# Altium schematic sheet pca10156_sheet3_debugger.SchDoc: =BoardTitle+' - IMCU'
size A3; Organization: Nordic Semiconductor; DocumentNumber: 3; SheetNumber: 3; SheetTotal: 7; CompanyName: Nordic Semiconductor; DocumentSize: A4
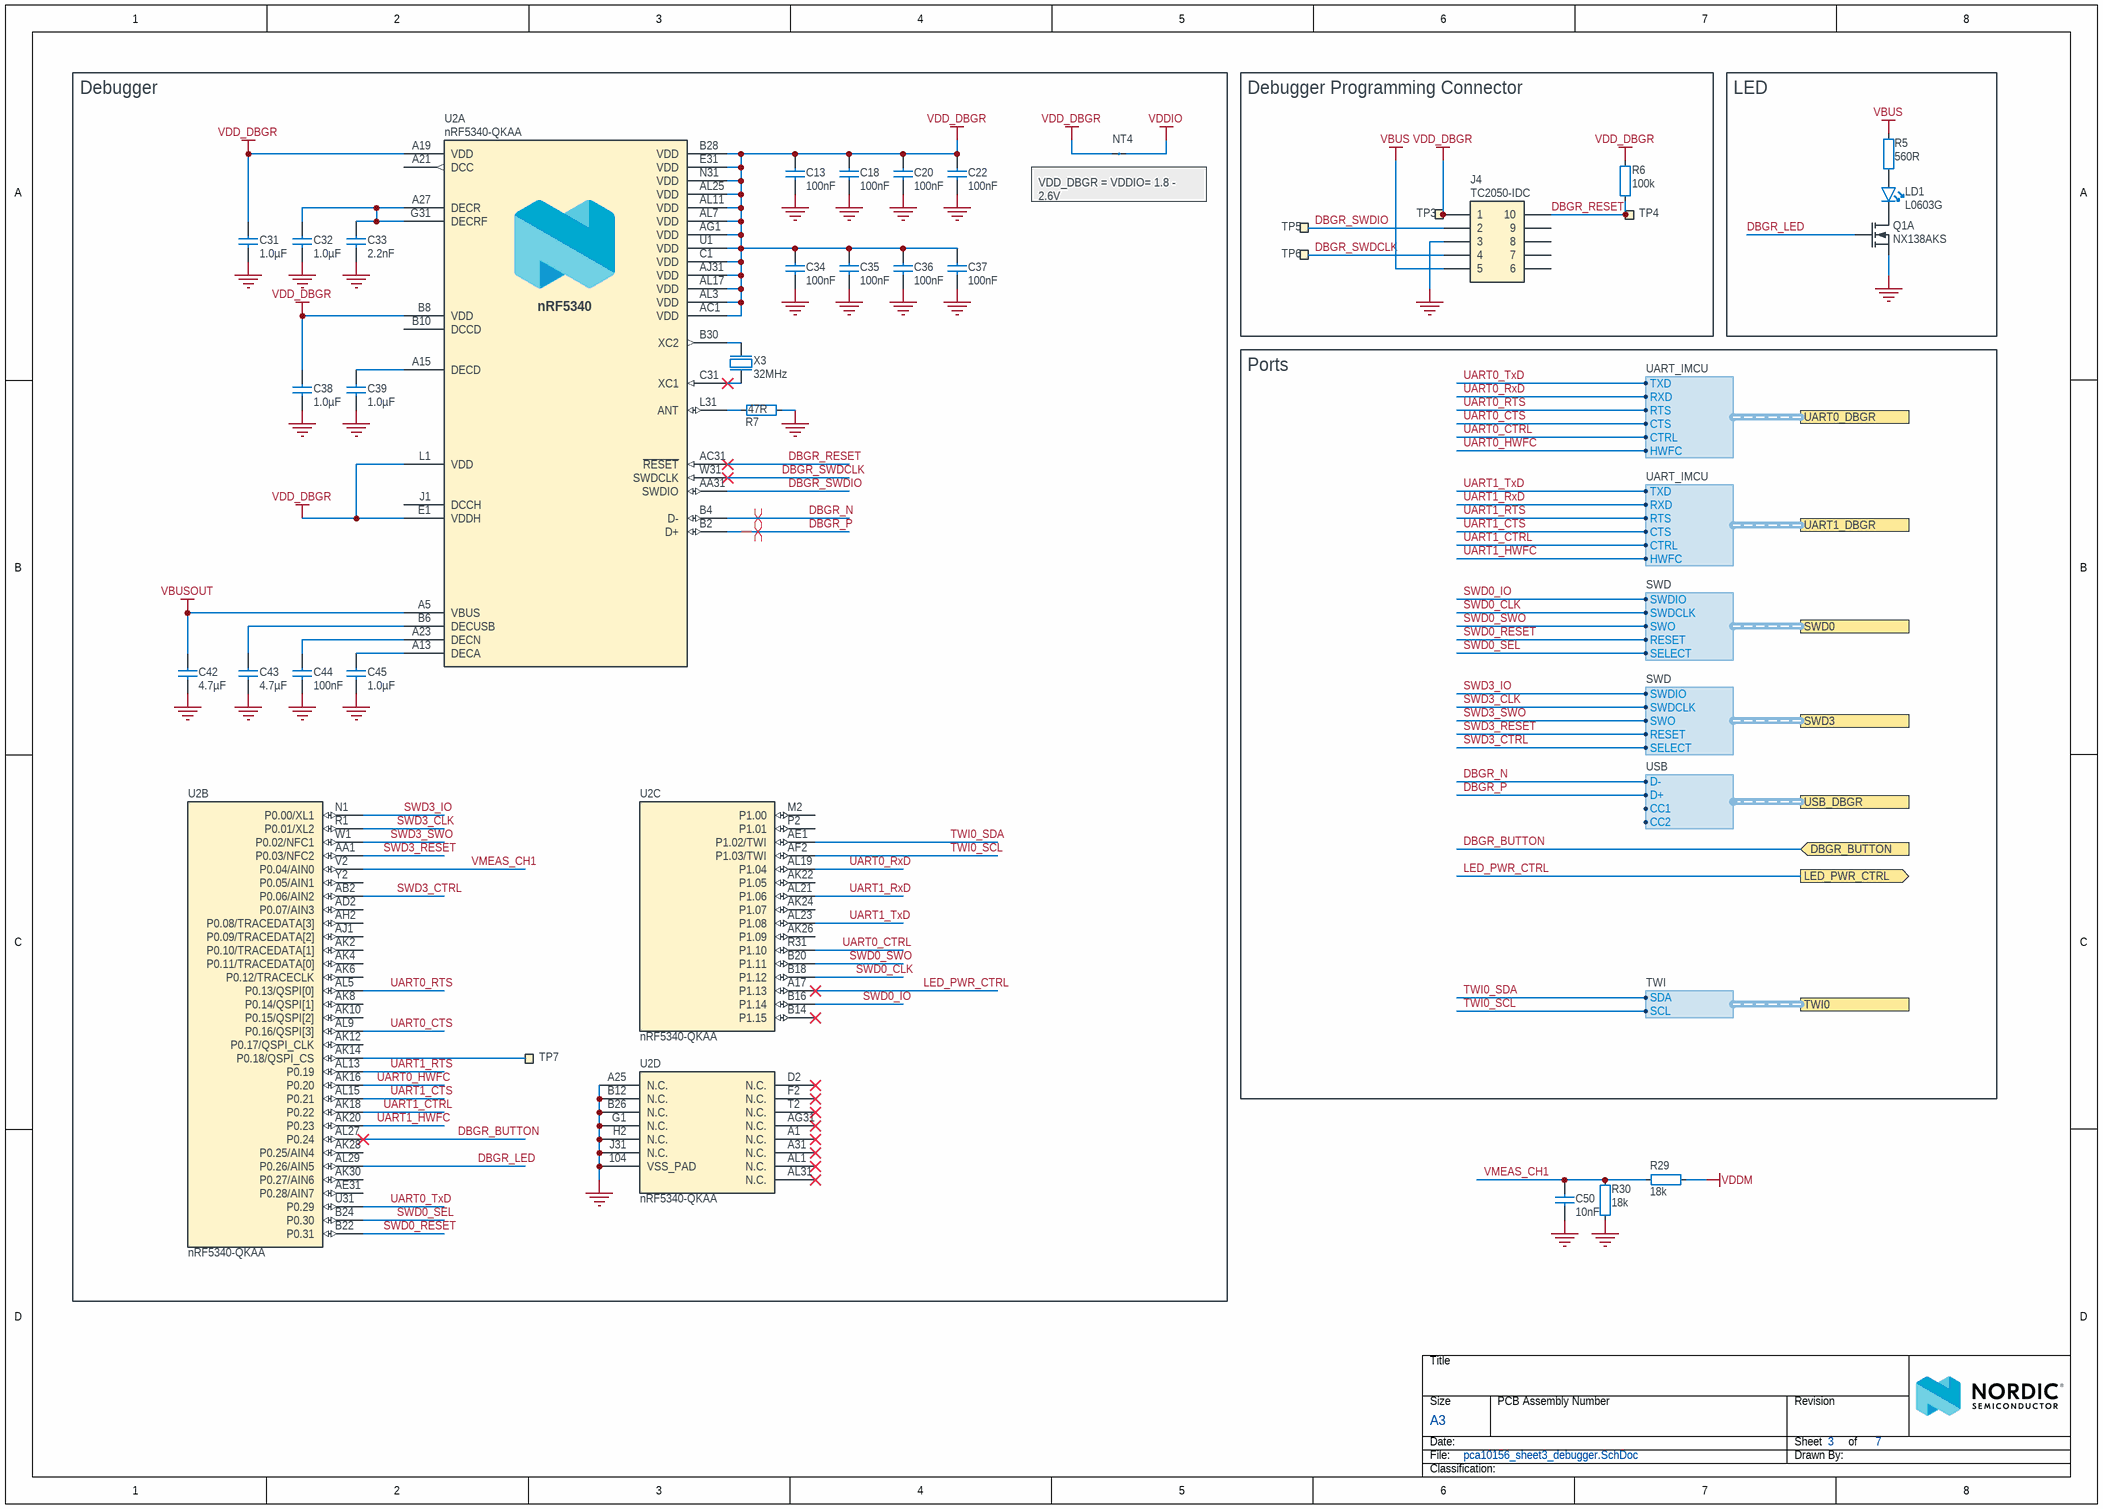
[diagram p0: pca10156_sheet3_debugger.SchDoc]

## Parts
C13  100nF  [CAPC0603X03L_C]
C18  100nF  [CAPC0603X03L_C]
C20  100nF  [CAPC0603X03L_C]
C22  100nF  [CAPC0603X03L_C]
C31  1.0µF  [CAPC1005X04L]
C32  1.0µF  [CAPC1005X04L]
C33  2.2nF  [CAPC0603X03L_C]
C34  100nF  [CAPC0603X03L_C]
C35  100nF  [CAPC0603X03L_C]
C36  100nF  [CAPC0603X03L_C]
C37  100nF  [CAPC0603X03L_C]
C38  1.0µF  [CAPC1005X04L]
C39  1.0µF  [CAPC1005X04L]
C42  4.7µF  [CAPC1608X06L]
C43  4.7µF  [CAPC1608X06L]
C44  100nF  [CAPC0603X03L_C]
C45  1.0µF  [CAPC1005X04L]
C50  10nF  [CAPC0603X03L_C]
J4  TC2050-IDC  [TC2050-IDC-NLFP]  (no BOM)
LD1  L0603G  [LED_0603_G]
NT4  N.A.  [2 pin starpoint 20mil]  (value not drawn)  (net tie, no BOM)
Q1  NX138AKS  [TSSOP6]  (part A of 2)
R5  560R  [RESC0603X03L_C]
R6  100k  [RESC0603X03L_C]
R7  47R  [RESC0603X03L_C]
R29  18k  [RESC0603X03L_C]
R30  18k  [RESC0603X03L_C]
TP3  Ø1.5mm,SMD  [TP_SMD_D1.5mm]  (value not drawn)  (no BOM)
TP4  Ø1.5mm,SMD  [TP_SMD_D1.5mm]  (value not drawn)  (no BOM)
TP5  Ø1.5mm,SMD  [TP_SMD_D1.5mm]  (value not drawn)  (no BOM)
TP6  Ø1.5mm,SMD  [TP_SMD_D1.5mm]  (value not drawn)  (no BOM)
TP7  Ø1.5mm,SMD  [TP_SMD_D1.5mm]  (value not drawn)  (no BOM)
U2  nRF5340-QKAA  [AQFN40P700X700X85_HS-99N]  (parts A,B,C,D of 4)
X3  32MHz  [BT-XTAL_2016]

## Blocks framed on the sheet
Debugger: C13 C18 C20 C22 C31-C39 C42-C45 NT4 R7 TP7 U2 X3
Debugger Programming Connector: J4 R6 TP3-TP6
LED: LD1 Q1 R5

## Ports
DBGR_BUTTON (in), LED_PWR_CTRL (out), SWD0 (harness SWD), SWD3 (harness SWD), TWI0 (harness TWI), UART0_DBGR (harness UART_IMCU), UART1_DBGR (harness UART_IMCU), USB_DBGR (harness USB)

## Harnesses
SWD: SWDIO, SWDCLK, SWO, RESET, SELECT
UART_IMCU: RTS, CTS, RXD, TXD, HWFC, CTRL
TWI: SCL, SDA
USB: D+, D-, CC1, CC2

## Nets
GND: C13.2 C18.2 C20.2 C22.2 C31.2 C32.1 C33.2 C34.2 C35.2 C36.2 C37.2 C38.1 C39.1 C42.2 C43.2 C44.2 C45.1 C50.2 J4.3 Q1.1(S1) R7.2 R30.1 U2.104(VSS_PAD) U2.A25(N.C.) U2.B12(N.C.) U2.B26(N.C.) U2.G1(N.C.) U2.H2(N.C.) U2.J31(N.C.) X3.2(GND) X3.4(GND)
VBUS: J4.5 R5.2
VBUSOUT: C42.1 U2.A5(VBUS)
VDD_DBGR: C13.1 C18.1 C20.1 C22.1 C31.1 C34.1 C35.1 C36.1 C37.1 C38.2 J4.1 NT4.1 R6.2 TP3.1 U2.A19(VDD) U2.AC1(VDD) U2.AG1(VDD) U2.AJ31(VDD) U2.AL3(VDD) U2.AL7(VDD) U2.AL11(VDD) U2.AL17(VDD) U2.AL25(VDD) U2.B8(VDD) U2.B28(VDD) U2.C1(VDD) U2.E1(VDDH) U2.E31(VDD) U2.L1(VDD) U2.N31(VDD) U2.U1(VDD)
VDDIO: NT4.2
VDDM: R29.2
DBGR_BUTTON: U2.AL27(P0.24) ; port DBGR_BUTTON
DBGR_LED: Q1.2(G1) U2.AL29(P0.26/AIN5)
DBGR_N: U2.B4(D-) ; port USB_DBGR.D-
DBGR_P: U2.B2(D+) ; port USB_DBGR.D+
DBGR_RESET: J4.10 R6.1 TP4.1 U2.AC31(~{RESET})
DBGR_SWDCLK: J4.4 TP6.1 U2.W31(SWDCLK)
DBGR_SWDIO: J4.2 TP5.1 U2.AA31(SWDIO)
LED_PWR_CTRL: U2.A17(P1.13) ; port LED_PWR_CTRL
SWD0_CLK: U2.B18(P1.12) ; port SWD0.SWDCLK
SWD0_IO: U2.B16(P1.14) ; port SWD0.SWDIO
SWD0_RESET: U2.B22(P0.31) ; port SWD0.RESET
SWD0_SEL: U2.B24(P0.30) ; port SWD0.SELECT
SWD0_SWO: U2.B20(P1.11) ; port SWD0.SWO
SWD3_CLK: U2.R1(P0.01/XL2) ; port SWD3.SWDCLK
SWD3_CTRL: U2.AB2(P0.06/AIN2) ; port SWD3.SELECT
SWD3_IO: U2.N1(P0.00/XL1) ; port SWD3.SWDIO
SWD3_RESET: U2.AA1(P0.03/NFC2) ; port SWD3.RESET
SWD3_SWO: U2.W1(P0.02/NFC1) ; port SWD3.SWO
TWI0_SCL: U2.AF2(P1.03/TWI) ; port TWI0.SCL
TWI0_SDA: U2.AE1(P1.02/TWI) ; port TWI0.SDA
UART0_CTRL: U2.R31(P1.10) ; port UART0_DBGR.CTRL
UART0_CTS: U2.AL9(P0.16/QSPI[3]) ; port UART0_DBGR.CTS
UART0_HWFC: U2.AK16(P0.20) ; port UART0_DBGR.HWFC
UART0_RTS: U2.AL5(P0.13/QSPI[0]) ; port UART0_DBGR.RTS
UART0_RxD: U2.AL19(P1.04) ; port UART0_DBGR.RXD
UART0_TxD: U2.U31(P0.29) ; port UART0_DBGR.TXD
UART1_CTRL: U2.AK18(P0.22) ; port UART1_DBGR.CTRL
UART1_CTS: U2.AL15(P0.21) ; port UART1_DBGR.CTS
UART1_HWFC: U2.AK20(P0.23) ; port UART1_DBGR.HWFC
UART1_RTS: U2.AL13(P0.19) ; port UART1_DBGR.RTS
UART1_RxD: U2.AL21(P1.06) ; port UART1_DBGR.RXD
UART1_TxD: U2.AL23(P1.08) ; port UART1_DBGR.TXD
VMEAS_CH1: C50.1 R29.1 R30.2 U2.V2(P0.04/AIN0)
NetC32_2: C32.2 C33.1 U2.A27(DECR) U2.G31(DECRF)
NetC39_2: C39.2 U2.A15(DECD)
NetC43_1: C43.1 U2.B6(DECUSB)
NetC44_1: C44.1 U2.A23(DECN)
NetC45_2: C45.2 U2.A13(DECA)
NetLD1_1: LD1.1(C) Q1.6(D1)
NetLD1_2: LD1.2(A) R5.1
NetR7_1: R7.1 U2.L31(ANT)
NetTP7_1: TP7.1 U2.AK14(P0.18/QSPI_CS)
NetU2_B30: U2.B30(XC2) X3.3(out)
NetU2_C31: U2.C31(XC1) X3.1(inp)

Not connected (* = marked no-connect by the designer): J4 6 7 8 9; U2 A1(N.C.)* A21(DCC) A31(N.C.)* AD2(P0.07/AIN3) AE31(P0.28/AIN7) AG31(N.C.)* AH2(P0.08/TRACEDATA[3]) AJ1(P0.09/TRACEDATA[2]) AK2(P0.10/TRACEDATA[1]) AK4(P0.11/TRACEDATA[0]) AK6(P0.12/TRACECLK) AK8(P0.14/QSPI[1]) AK10(P0.15/QSPI[2]) AK12(P0.17/QSPI_CLK) AK22(P1.05) AK24(P1.07) AK26(P1.09) AK28(P0.25/AIN4) AK30(P0.27/AIN6) AL1(N.C.)* AL31(N.C.)* B10(DCCD) B14(P1.15)* D2(N.C.)* F2(N.C.)* J1(DCCH) M2(P1.00) P2(P1.01) T2(N.C.)* Y2(P0.05/AIN1)

## Layout directives
differential pair; differential pair class IMCU; net class IMCU_USB: DBGR_N, DBGR_P

## Notes on the sheet
- (near NT4) VDD_DBGR = VDDIO= 1.8 - 2.6V
- Ports
- Title
- Size
- Date:
- File:
- A3
- PCB Assembly Number
- Sheet
- Drawn By:
- Revision
- of
- Classification:
- (in symbol nRF5340-QKAAD0, part A) nRF5340

## Library data of the parts
C13 C18 C20 C22 C34-C37 C44 = C0201-100n: Capacitor, X5R, ±10%; Manufacturer: N.A.; Part number IPS: 00000001248, 00000002505; Part number Norautron: 262071862; Part number NEMS: 100200078; Pad Count: 2; Note: 16V; Component Status: Active; Part Number: C0201-100n; Value: 100nF; Footprint Doc: 0201; Component Class: Capacitors; Author: rsk; PartId: 100200078; Manufacturer Part Number: N.A.; ComponentLink1URL: N.A.; ComponentLink1Description: Datasheet; ComponentLink2URL: N.A.; ComponentLink2Description: Supplier link; HelpURL: N.A.; LatestRevisionDate: 2017-11-09; Published: 2014-11-13; Supplier 1: N.A.; Supplier Part Number 1: N.A.; Supplier 2: N.A.; Supplier Part Number 2: N.A.; Artikkelnr Noca: N.A.
C31 C32 C38 C39 C45 = C0402-1µ0-6.3V-X5R-10%: Capacitor, X5R, ±10%, 6.3V; Manufacturer: N.A.; Part number Norautron: 26207137; Part number NEMS: 100200498; Pad Count: 2; Component Status: Active; Part Number: C0402-1µ0-6.3V-X5R-10%; Manufacturer Part Number: N.A.; LatestRevisionDate: 2022-01-27; Published: 2022-01-27; Value: 1.0µF; Note: 6.3V; Artikkelnr Noca: N.A.; Footprint Doc: 0402; ComponentLink1URL: N.A.; ComponentLink1Description: Datasheet; ComponentLink2URL: N.A.; ComponentLink2Description: Supplier link; HelpURL: N.A.; Supplier 1: N.A.; Supplier Part Number 1: N.A.; Supplier 2: N.A.; Supplier Part Number 2: N.A.; Part number IPS: N.A.; Component Class: Capacitors; PartId: 100200498; Author: rubr
C33 = C0201-2n2: Capacitor, X7R, ±10%, 10V; Manufacturer: N.A.; Part number IPS: 00000001778; Part number Norautron: 26470002; Part number NEMS: 100200060; Pad Count: 2; Component Status: Active; Part Number: C0201-2n2; LatestRevisionDate: 2014-11-13; Published: 2014-11-13; Value: 2.2nF; Footprint Doc: 0201; Manufacturer Part Number: N.A.; ComponentLink1URL: N.A.; ComponentLink1Description: Datasheet; ComponentLink2URL: N.A.; ComponentLink2Description: Supplier link; HelpURL: N.A.; Note: 10V; Supplier 1: N.A.; Supplier Part Number 1: N.A.; Supplier 2: N.A.; Supplier Part Number 2: N.A.; Artikkelnr Noca: N.A.; Component Class: Capacitors; PartId: 100200060; Author: rsk
C42 C43 = C0603-4µ7-10V-X7S: Capacitor, X7S, ±10%, 10V; Manufacturer: N.A.; Part number IPS: 00000001779; Part number NEMS: 100200351; Pad Count: 2; Artikkelnr Noca: 20030013; Component Status: Active; Part Number: C0603-4µ7-10V-X7S; Value: 4.7µF; Footprint Doc: 0603; Component Class: Capacitors; Author: rsk; PartId: 100200351; Manufacturer Part Number: N.A.; ComponentLink1URL: N.A.; ComponentLink1Description: Datasheet; ComponentLink2URL: N.A.; ComponentLink2Description: Supplier link; HelpURL: N.A.; LatestRevisionDate: 2016-08-15; Published: 2016-08-15; Note: 10V; Supplier 1: Digi-Key; Supplier Part Number 1: 445-14258-1-ND; Supplier 2: N.A.; Supplier Part Number 2: N.A.; Part number Norautron: N.A.
C50 = C0201-10n: Capacitor, X7R, ±10%; Manufacturer: N.A.; Part number IPS: 00000003480; Part number Norautron: 26621779; Part number NEMS: 100200067; Note: 10V; Assembly: Not Mounted; Pad Count: 2; Component Status: Active; Part Number: C0201-10n; Manufacturer Part Number: N.A.; LatestRevisionDate: 2017-11-09; Published: 2014-11-13; Value: 10nF; Artikkelnr Noca: N.A.; Footprint Doc: 0201; ComponentLink1URL: N.A.; ComponentLink1Description: Datasheet; ComponentLink2URL: N.A.; ComponentLink2Description: Supplier link; HelpURL: N.A.; Supplier 1: N.A.; Supplier Part Number 1: N.A.; Supplier 2: N.A.; Supplier Part Number 2: N.A.; Component Class: Capacitors; PartId: 100200067; Author: rsk
J4 = TC2050-IDC-NLFP: CBL PLUG-OF-NAILS 10-PIN; Manufacturer: Tag-Connect LLC; Part number NEMS: 100500463; Artikkelnr Noca: N.A.; Pad Count: 10; Component Status: Active; System: Connector; Part Number: TC2050-IDC-NLFP; Manufacturer Part Number: TC2050-IDC-NLFP; LatestRevisionDate: 2012-11-21; Published: 2012-11-21; Value: TC2050-IDC; Footprint Doc: TC2050-IDC-NLFP; Part number IPS: N.A.; ComponentLink1URL: N.A.; ComponentLink1Description: Datasheet; ComponentLink2URL: N.A.; ComponentLink2Description: Supplier link; HelpURL: http://www.tag-connect.com/Materials/TC2050-IDC%20Datasheet.pdf; Supplier 1: Digi-Key; Supplier Part Number 1: TC2050-IDC-NL-ND; Supplier 2: N.A.; Supplier Part Number 2: N.A.; Component Class: Connectors; Note: N.A.; PartId: 100500463; Author: rsk; Part number Norautron: N.A.
LD1 = VS 25C7M5: LED, Green, 0603, 573nm, Vf=2.0V, 24mcd, - 40 to +85°C; Manufacturer: Victory Electronics; Part number IPS: 00000001274, 00000009961; Part number Norautron: 26313411; Part number NEMS: 101400097; Pad Count: 2; Note: N.A.; Artikkelnr Noca: 13019193; Component Status: Active; Part Number: VS 25C7M5; PartId: 101400097; Component Class: Optoelectronics; Author: rsk; Manufacturer Part Number: VS 25C7M5; ComponentLink1URL: N.A.; ComponentLink1Description: Datasheet; ComponentLink2URL: N.A.; ComponentLink2Description: Supplier link; HelpURL: \\hizz\pro\app9717\Datasheet\optoelectronics\Victory Electronics\VS 25C7M5.pdf; Footprint Doc: 0603; LatestRevisionDate: 2020-10-23; Published: 2017-08-21; Value: L0603G; Supplier 1: EC Partner; Supplier Part Number 1: N.A.; Supplier 2: N.A.; Supplier Part Number 2: N.A.
NT4 = 2 pin starpoint 20mil: Starpoint; Part number NEMS: 100500717; Component Status: Active; Pad Count: 2; System: Connector; Part Number: 2 pin starpoint 20mil; PartId: 100500717; Component Class: Connectors; Author: getr; Manufacturer: N.A.; Manufacturer Part Number: N.A.; ComponentLink1URL: N.A.; ComponentLink1Description: Datasheet; ComponentLink2URL: N.A.; ComponentLink2Description: Supplier link; HelpURL: N.A.; LatestRevisionDate: 2021-05-18; Published: 2021-05-18; Footprint Doc: N.A.; Value: N.A.; Note: N.A.; Supplier 1: N.A.; Supplier Part Number 1: N.A.; Supplier 2: N.A.; Supplier Part Number 2: N.A.; Artikkelnr Noca: N.A.; Part number IPS: N.A.; Part number Norautron: N.A.
Q1 = NX138AKS: MOSFET 2N-CH 60V 0.17A TSSOP6 (SOT363); Manufacturer: Nexperia; Manufacturer Part Number: NX138AKSX; Part number NEMS: 101300207; Component Status: Active; Pad Count: 6; Note: N.A.; Part Number: NX138AKS; Component Class: Semiconductors; Author: stl1; ComponentLink1URL: https://assets.nexperia.com/documents/data-sheet/NX138AKS.pdf; ComponentLink1Description: Datasheet; ComponentLink2URL: N.A.; ComponentLink2Description: Supplier link; HelpURL: N.A.; LatestRevisionDate: 2023-11-20; Published: 2023-11-20; Footprint Doc: TSSOP6; Value: NX138AKS; Supplier 1: Digi-Key; Supplier Part Number 1: 1727-2732-2-ND; Supplier 2: Mouser; Supplier Part Number 2: 771-NX138AKSX; Artikkelnr Noca: N.A.; Part number IPS: N.A.; Part number Norautron: N.A.; PartId: 101300207
R5 = R0201-560: Resistor, ±1%, 0.05W; Manufacturer: N.A.; Part number NEMS: 100100038; Note: Chip Res 1%; Pad Count: 2; Component Status: Active; Part Number: R0201-560; Manufacturer Part Number: N.A.; ComponentLink1URL: N.A.; ComponentLink1Description: Datasheet; ComponentLink2URL: N.A.; ComponentLink2Description: Supplier link; HelpURL: N.A.; Footprint Doc: 0201; LatestRevisionDate: 2014-11-13; Published: 2014-11-13; Value: 560R; Supplier 1: N.A.; Supplier Part Number 1: N.A.; Supplier 2: N.A.; Supplier Part Number 2: N.A.; Artikkelnr Noca: N.A.; Part number IPS: N.A.; PartId: 100100038; Component Class: Resistors; Author: rsk; Part number Norautron: N.A.
R6 = R0201-100k: Resistor, ±1%, 0.05W; Manufacturer: N.A.; Part number IPS: 00000001419; Part number Norautron: 26108487; Part number NEMS: 100100080; Note: Chip Res 1%; Pad Count: 2; Component Status: Active; Part Number: R0201-100k; Manufacturer Part Number: N.A.; ComponentLink1URL: N.A.; ComponentLink1Description: Datasheet; ComponentLink2URL: N.A.; ComponentLink2Description: Supplier link; HelpURL: N.A.; Footprint Doc: 0201; LatestRevisionDate: 2014-11-13; Published: 2014-11-13; Value: 100k; Artikkelnr Noca: N.A.; Supplier 1: N.A.; Supplier Part Number 1: N.A.; Supplier 2: N.A.; Supplier Part Number 2: N.A.; Component Class: Resistors; PartId: 100100080; Author: rsk
R7 = R0201-47R: Resistor, ±1%, 0.05W; Manufacturer: N.A.; Part number IPS: 00000004794; Part number Norautron: 26108300; Part number NEMS: 100100022; Component Status: Active; Pad Count: 2; Note: Chip Res 1%; Part Number: R0201-47R; PartId: 100100022; Component Class: Resistors; Author: rsk; Manufacturer Part Number: N.A.; ComponentLink1URL: N.A.; ComponentLink1Description: Datasheet; ComponentLink2URL: N.A.; ComponentLink2Description: Supplier link; HelpURL: N.A.; LatestRevisionDate: 2014-11-13; Published: 2014-11-13; Footprint Doc: 0201; Value: 47R; Supplier 1: N.A.; Supplier Part Number 1: N.A.; Supplier 2: N.A.; Supplier Part Number 2: N.A.; Artikkelnr Noca: N.A.
R29 R30 = R0201-18k: Resistor, ±1%, 0.05W; Manufacturer: N.A.; Part number IPS: 00000001707; Part number NEMS: 100100069; Component Status: Active; Pad Count: 2; Note: Chip Res 1%; Assembly: Not Mounted; Part Number: R0201-18k; PartId: 100100069; Component Class: Resistors; Author: rsk; Manufacturer Part Number: N.A.; ComponentLink1URL: N.A.; ComponentLink1Description: Datasheet; ComponentLink2URL: N.A.; ComponentLink2Description: Supplier link; HelpURL: N.A.; LatestRevisionDate: 2014-11-13; Published: 2014-11-13; Footprint Doc: 0201; Value: 18k; Supplier 1: N.A.; Supplier Part Number 1: N.A.; Supplier 2: N.A.; Supplier Part Number 2: N.A.; Artikkelnr Noca: N.A.; Part number Norautron: N.A.
TP3-TP7 = TP_SMD_Ø1.5MM: 1.5mm circular SMD testpad; Manufacturer: Nordic Semiconductor; Manufacturer Part Number: N.A.; Part number NEMS: 100500477; Pad Count: 1; Component Status: Active; Part Number: TP_SMD_Ø1.5MM; ComponentLink1URL: N.A.; ComponentLink1Description: Datasheet; ComponentLink2URL: N.A.; ComponentLink2Description: Supplier link; HelpURL: N.A.; Footprint Doc: TP_SMD_Ø1.5mm; LatestRevisionDate: 2021-03-05; Published: 2016-06-02; Value: Ø1.5mm,SMD; Note: N.A.; Artikkelnr Noca: N.A.; Part number IPS: N.A.; Supplier 1: N.A.; Supplier Part Number 1: N.A.; Supplier 2: N.A.; Supplier Part Number 2: N.A.; Component Class: Connectors; PartId: 100500477; Author: rsk; Part number Norautron: N.A.
U2 = nRF5340-QKAAD0: Multi-protocol Bluetooth Low Energy, IEEE 802.15.4, ANT and 2.4GHz proprietary system-on-chip; Manufacturer: Nordic Semiconductor; Part number Norautron: NOD26470035; Part number NEMS: 102000216; Pad Count: 98; Note: N.A.; Component Status: Active; Part Number: nRF5340-QKAAD0; Footprint Doc: AQFN-98; Value: nRF5340-QKAA; Component Class: Nordic_Devices; Author: rsk; PartId: 102000216; Manufacturer Part Number: nRF5340-QKAAD0; ComponentLink1URL: N.A.; ComponentLink1Description: Datasheet; ComponentLink2URL: N.A.; ComponentLink2Description: Supplier link; HelpURL: N.A.; LatestRevisionDate: 2020-12-02; Published: 2020-12-02; Supplier 1: Nordic Semiconductor; Supplier Part Number 1: nRF5340-QKAAD0; Supplier 2: N.A.; Supplier Part Number 2: N.A.; Artikkelnr Noca: N.A.; Part number IPS: N.A.
X3 = XTAL_SMD2016_32MHz_8pF_Golledge: XTAL SMD 2016, 32MHz, Cl=8pF, Tol: ±10ppm, Stab: ±15ppm; Manufacturer Part Number: MP06003; Part number IPS: 00000001431; Part number Norautron: N.A.; Part number NEMS: 101600041; Component Status: Active; Pad Count: 4; Note: XTAL SMD 32.000MHz; Artikkelnr Noca: 22010050; Part Number: XTAL_SMD2016_32MHz_8pF_Golledge; PartId: 101600041; Component Class: Oscillators; Author: rsk; Manufacturer: Golledge; ComponentLink1URL: N.A.; ComponentLink1Description: Datasheet; ComponentLink2URL: N.A.; ComponentLink2Description: Supplier link; HelpURL: \\hizz\pro\app9717\Datasheet\crystals\Golledge\mp06003.pdf; LatestRevisionDate: 2016-11-02; Published: 2016-11-02; Footprint Doc: XTAL_2016; Value: 32MHz; Supplier 1: Link Nordic; Supplier Part Number 1: N.A.; Supplier 2: N.A.; Supplier Part Number 2: N.A.